# EAGLE design Input_v1_0 (EAGLE 9.6.2)
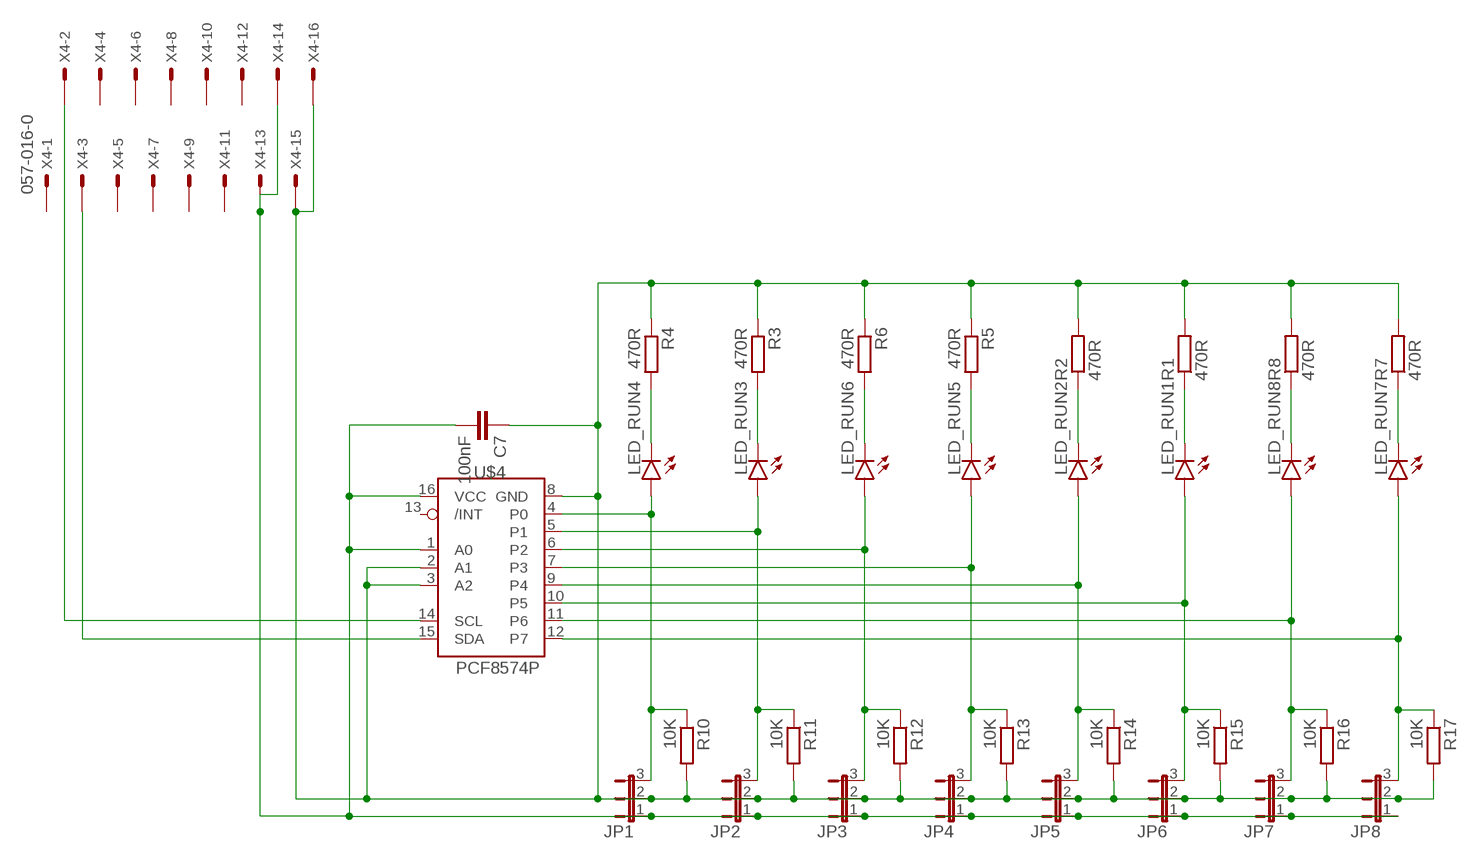
[diagram p0: schematic, sheet 1]

## Parts
C7  100nF  C-EU025-024X044  [C025-024X044]
JP1  JP2E  [JP2]
JP2  JP2E  [JP2]
JP3  JP2E  [JP2]
JP4  JP2E  [JP2]
JP5  JP2E  [JP2]
JP6  JP2E  [JP2]
JP7  JP2E  [JP2]
JP8  JP2E  [JP2]
LED_RUN1  LED3MM  [LED3MM]
LED_RUN2  LED3MM  [LED3MM]
LED_RUN3  LED3MM  [LED3MM]
LED_RUN4  LED3MM  [LED3MM]
LED_RUN5  LED3MM  [LED3MM]
LED_RUN6  LED3MM  [LED3MM]
LED_RUN7  LED3MM  [LED3MM]
LED_RUN8  LED3MM  [LED3MM]
R1  470R  R-EU_0309/10  [0309/10]
R2  470R  R-EU_0309/10  [0309/10]
R3  470R  R-EU_0309/10  [0309/10]
R4  470R  R-EU_0309/10  [0309/10]
R5  470R  R-EU_0309/10  [0309/10]
R6  470R  R-EU_0309/10  [0309/10]
R7  470R  R-EU_0309/10  [0309/10]
R8  470R  R-EU_0309/10  [0309/10]
R10  10K  R-EU_0309/10  [0309/10]
R11  10K  R-EU_0309/10  [0309/10]
R12  10K  R-EU_0309/10  [0309/10]
R13  10K  R-EU_0309/10  [0309/10]
R14  10K  R-EU_0309/10  [0309/10]
R15  10K  R-EU_0309/10  [0309/10]
R16  10K  R-EU_0309/10  [0309/10]
R17  10K  R-EU_0309/10  [0309/10]
U$4  PCF8574P  [DIL16]
X4  057-016-0  [057-016-0]

## Nets
GND1: C7.1 JP1.2 JP2.2 JP3.2 JP4.2 JP5.2 JP6.2 JP7.2 JP8.2 R1.2 R2.2 R3.1 R4.1 R5.1 R6.1 R7.2 R8.2 R10.2 R11.2 R12.2 R13.2 R14.2 R15.2 R16.2 R17.2 U$4.2(A1) U$4.3(A2) U$4.8(GND) X4.15 X4.16
N$1: LED_RUN7.K(C) R7.1
N$2: LED_RUN8.K(C) R8.1
N$3: LED_RUN1.K(C) R1.1
N$4: LED_RUN2.K(C) R2.1
N$5: LED_RUN5.K(C) R5.2
N$6: LED_RUN6.K(C) R6.2
N$7: LED_RUN3.K(C) R3.2
N$8: LED_RUN4.K(C) R4.2
N$9: U$4.15(SDA) X4.3
N$21: JP1.3 LED_RUN4.A R10.1 U$4.4(P0)
N$22: JP2.3 LED_RUN3.A R11.1 U$4.5(P1)
N$23: JP3.3 LED_RUN6.A R12.1 U$4.6(P2)
N$24: JP4.3 LED_RUN5.A R13.1 U$4.7(P3)
N$25: JP5.3 LED_RUN2.A R14.1 U$4.9(P4)
N$26: JP6.3 LED_RUN1.A R15.1 U$4.10(P5)
N$27: JP7.3 LED_RUN8.A R16.1 U$4.11(P6)
N$28: JP8.3 LED_RUN7.A R17.1 U$4.12(P7)
SCL: U$4.14(SCL) X4.2
VCC5.0: C7.2 JP1.1 JP2.1 JP3.1 JP4.1 JP5.1 JP6.1 JP7.1 JP8.1 U$4.1(A0) U$4.16(VCC) X4.13 X4.14
Unconnected: U$4.13(/INT) X4.1 X4.4 X4.5 X4.6 X4.7 X4.8 X4.9 X4.10 X4.11 X4.12

## Library data of the parts
C7 = resistor:C-EU: CAPACITOR, European symbol
JP1-JP8 = jumper:JP2E: JUMPER
LED_RUN1-LED_RUN8 = led:LED: LED OSRAM: - CHIPLED LG R971, LG N971, LY N971, LG Q971, LY Q971, LO R971, LY R971 LH N974, LH R974 LS Q976, LO Q976, LY Q976 LO Q996 - Hyper CHIPLED LW Q18S LB Q993, LB Q99A, LB R99A - SideLED LS A670, LO A670, LY A670, LG A670, LP A670 LB A673, LV A673, LT A673, LW A673 LH A674 LY A675 LS A676, LA A676, LO A676, LY A676, LW A676 LS A679, LY A679, LG A679 - Hyper Micro SIDELED® LS Y876, LA Y876, LO Y876, LY Y876 LT Y87S - SmartLED LW L88C, LW L88S LB L89C, LB L89S, LG L890 LS L89K, LO L89K, LY L89K LS L896, LA L896, LO L896, LY L896 - TOPLED LS T670, LO T670, LY T670, LG T670, LP T670 LSG T670, LSP T670, LSY T670, LOP T670, LYG T670 LG T671, LOG T671, LSG T671 LB T673, LV T673, LT T673, LW T673 LH T674 LS T676, LA T676, LO T676, LY T676, LB T676, LH T676, LSB T676, LW T676 LB T67C, LV T67C, LT T67C, LS T67K, LO T67K, LY T67K, LW E67C LS E67B, LA E67B, LO E67B, LY E67B, LB E67C, LV E67C, LT E67C LW T67C LS T679, LY T679, LG T679 LS T770, LO T770, LY T770, LG T770, LP T770 LB T773, LV T773, LT T773, LW T773 LH T774 LS E675, LA E675, LY E675, LS T675 LS T776, LA T776, LO T776, LY T776, LB T776 LHGB T686 LT T68C, LB T68C - Hyper Mini TOPLED® LB M676 - Mini TOPLED Santana® LG M470 LS M47K, LO M47K, LY M47K Source: http://www.osram.convergy.de LUXEON: - LUMILED® LXK2-PW12-R00, LXK2-PW12-S00, LXK2-PW14-U00, LXK2-PW14-V00 LXK2-PM12-R00, LXK2-PM12-S00, LXK2-PM14-U00 LXK2-PE12-Q00, LXK2-PE12-R00, LXK2-PE12-S00, LXK2-PE14-T00, LXK2-PE14-U00 LXK2-PB12-K00, LXK2-PB12-L00, LXK2-PB12-M00, LXK2-PB14-N00, LXK2-PB14-P00, LXK2-PB14-Q00 LXK2-PR12-L00, LXK2-PR12-M00, LXK2-PR14-Q00, LXK2-PR14-R00 LXK2-PD12-Q00, LXK2-PD12-R00, LXK2-PD12-S00 LXK2-PH12-R00, LXK2-PH12-S00 LXK2-PL12-P00, LXK2-PL12-Q00, LXK2-PL12-R00 Source: www.luxeon.com KINGBRIGHT: KA-3528ASYC Source: www.kingbright.com
R1-R8 R10-R17 = resistor:R-EU_: RESISTOR, European symbol
U$4 = i2c:PCF8574: Remote 8-Bit I/O Expander for I²C Bus
X4 = con-panduit:057-016-: CONNECTOR 10-pin series 057 contact pc board low profile headers; OC_FARNELL: unknown; OC_NEWARK: unknown

## Board
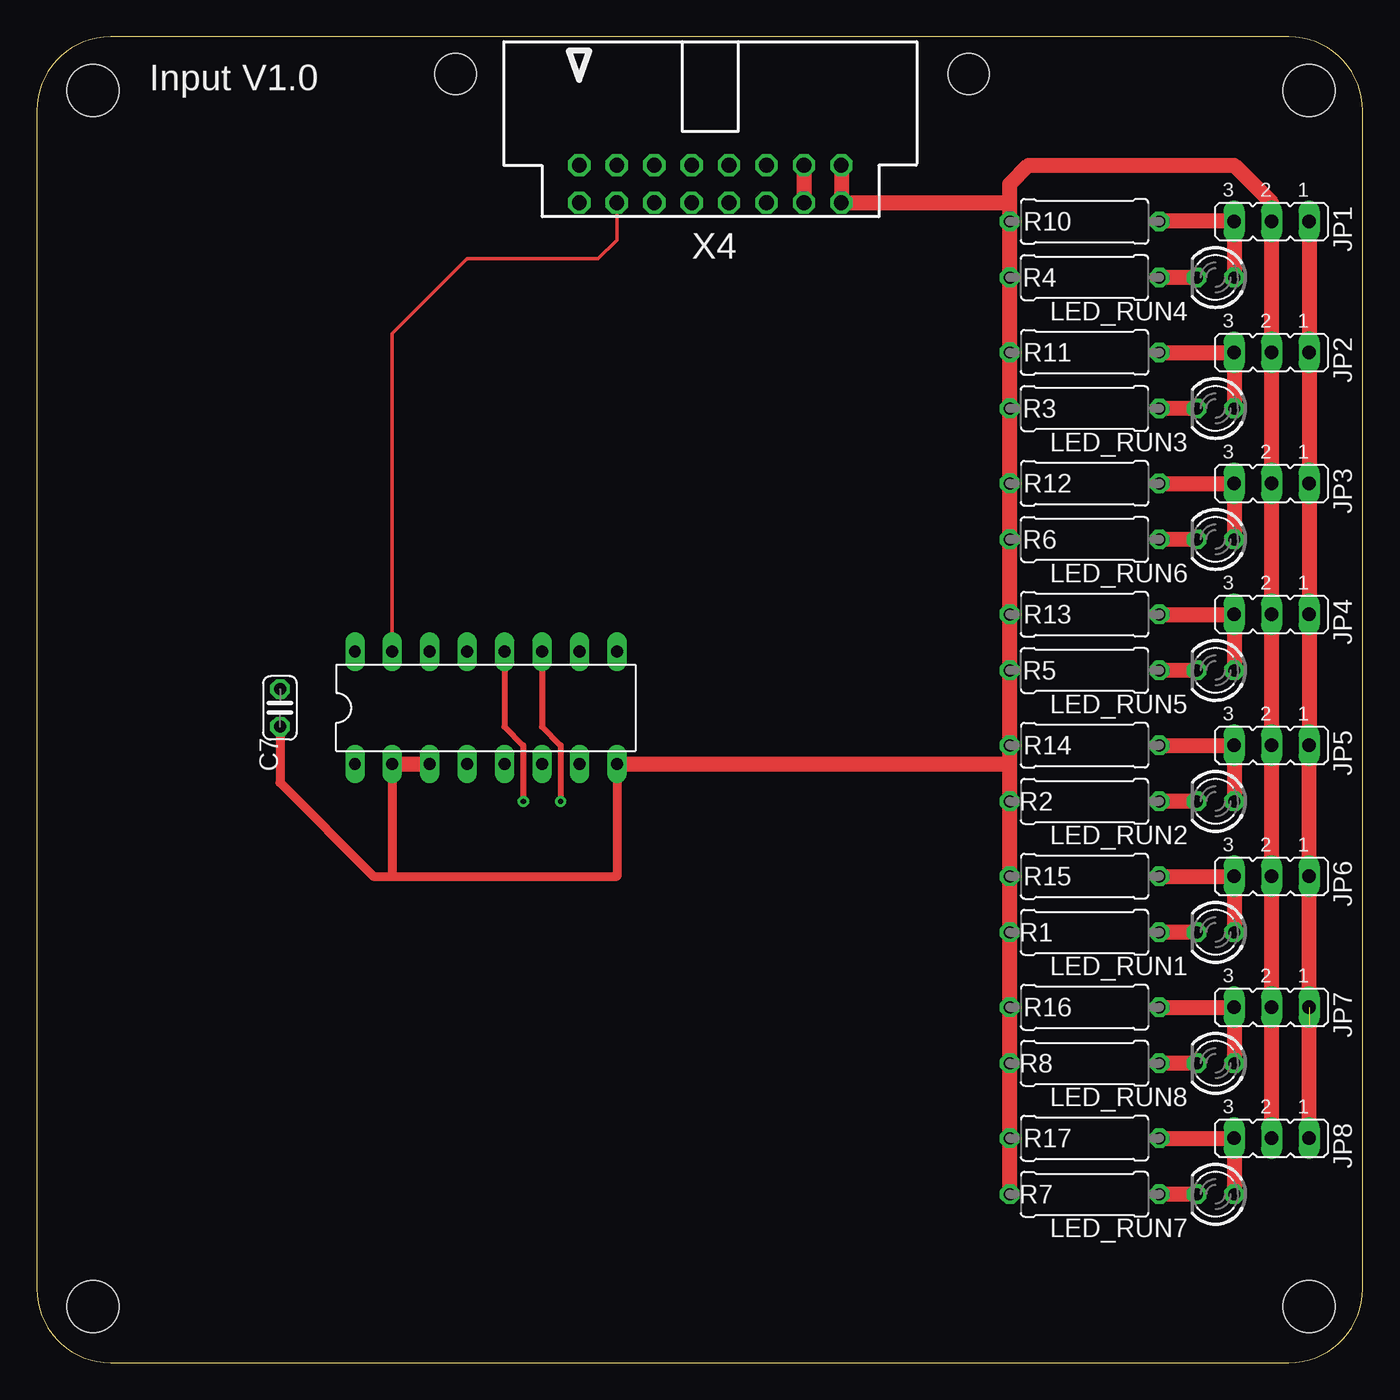
[diagram p1: board, top side]
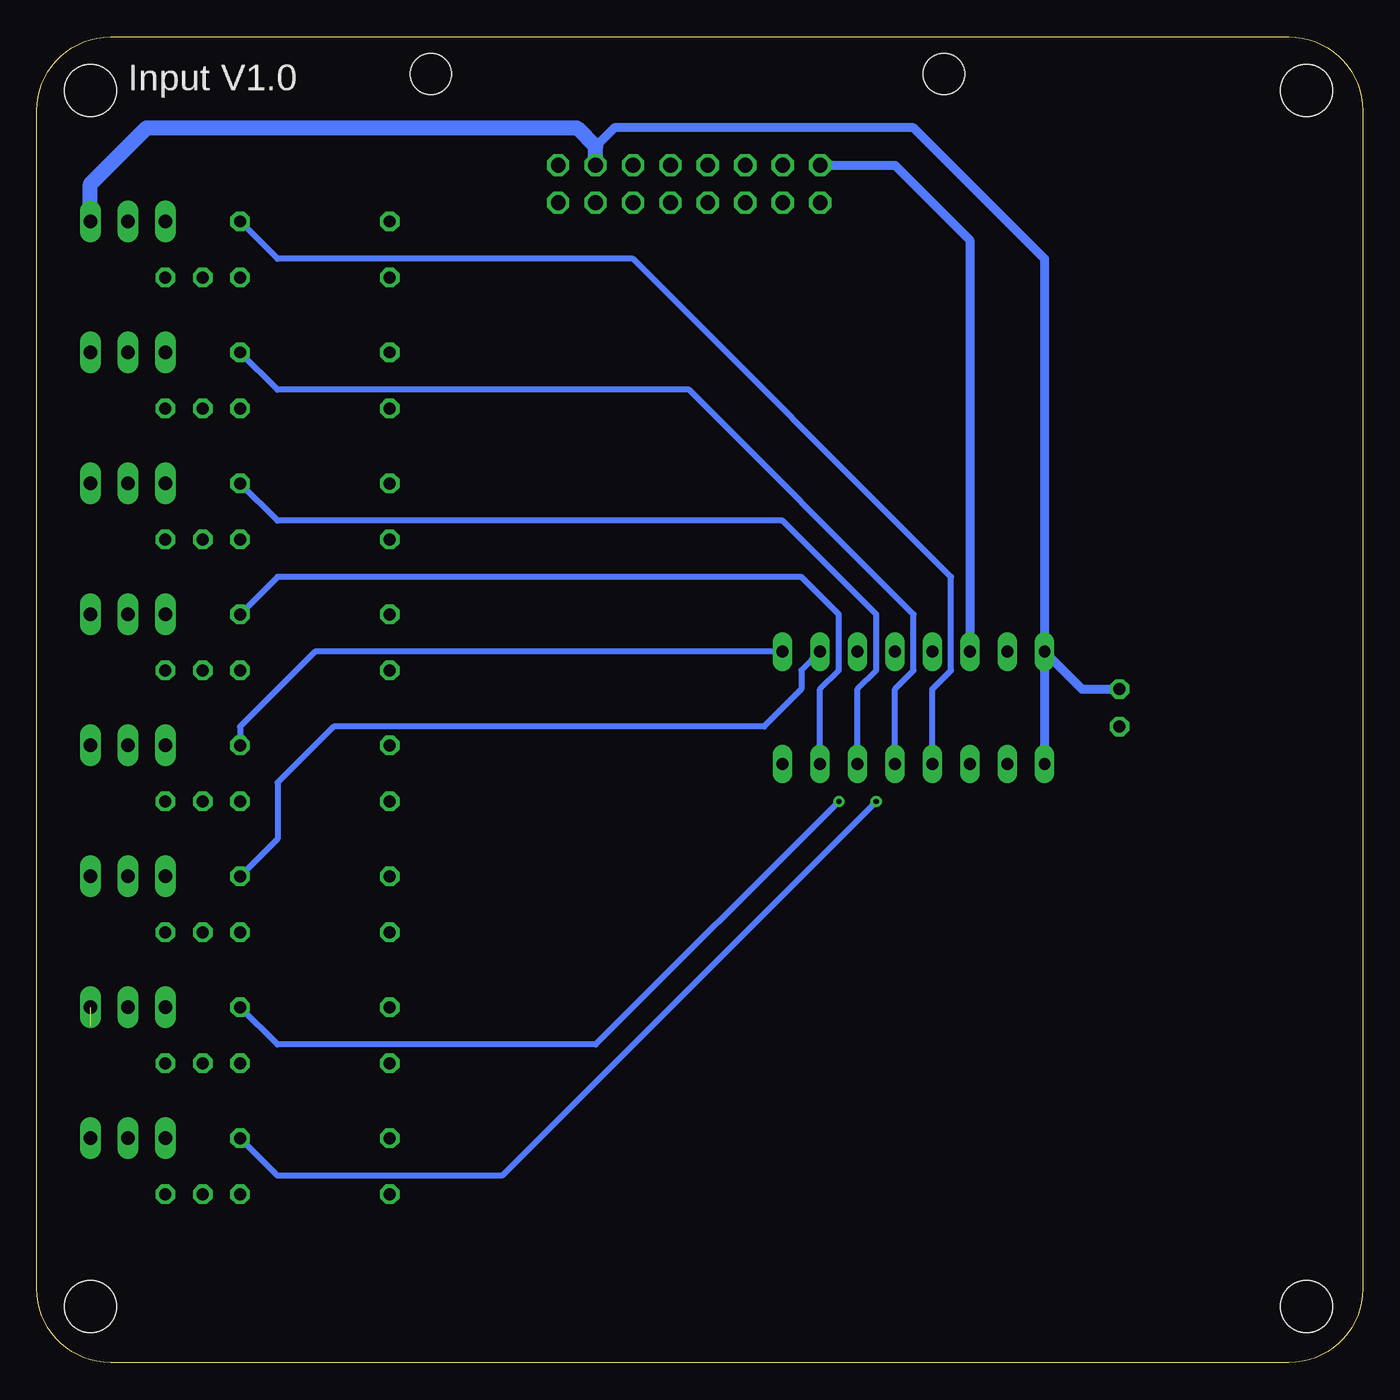
[diagram p2: board, bottom side, seen from below]

Size 90 x 90 mm. Coordinates in mm from the lower left corner, seen from the top.
Outline: 0,85 0,5 arc90 5,0 85,0 arc90 90,5 90,85 arc90 85,90 5,90 arc90 0,85
Copper layers (1*16): Top 0.035mm / dielectric 1.5mm / Bottom 0.035mm
Design rules "default": minimum track width 6mil, minimum drill 0.35mm, track to track 6mil, track to pad 6mil, pad to pad 6mil, via to via 6mil, smd to smd 6mil, copper to edge 40mil, drill to drill 6mil, minimum pad ring 10mil, minimum via ring 8mil, stop-mask expansion 4mil, vias tented up to drill 0mil, thermal gap 10mil
Holes 3.5 mm at 86.36,86.36 3.81,86.36 3.81,3.81 86.36,3.81

### Footprints (pad centres in the part's own frame; a part is rotated, then mirrored left to right if it is on the bottom)
C025-024X044 = drill 0.813 octagon: 1 -1.27,0; 2 1.27,0
JP2 = drill 0.914 long: 1 -2.54,0; 2 0,0; 3 2.54,0
LED3MM = drill 0.813 octagon: A -1.27,0; K 1.27,0
0309/10 = drill 0.813 octagon: 1 -5.08,0; 2 5.08,0
DIL16 = drill 0.813 long: 1 -8.89,-3.81; 2 -6.35,-3.81; 3 -3.81,-3.81; 4 -1.27,-3.81; 5 1.27,-3.81; 6 3.81,-3.81; 7 6.35,-3.81; 8 8.89,-3.81; 9 8.89,3.81; 10 6.35,3.81; 11 3.81,3.81; 12 1.27,3.81; 13 -1.27,3.81; 14 -3.81,3.81; 15 -6.35,3.81; 16 -8.89,3.81
057-016-0 = drill 1 octagon: 1 -8.89,-5.08; 2 -8.89,-2.54; 3 -6.35,-5.08; 4 -6.35,-2.54; 5 -3.81,-5.08; 6 -3.81,-2.54; 7 -1.27,-5.08; 8 -1.27,-2.54; 9 1.27,-5.08; 10 1.27,-2.54; 11 3.81,-5.08; 12 3.81,-2.54; 13 6.35,-5.08; 14 6.35,-2.54; 15 8.89,-5.08; 16 8.89,-2.54 | hole 2.8: -17.29,3.66; 17.54,3.66

### Placement (x,y rotation side)
C7  16.51,44.45 90 top
JP1  83.82,77.47 180 top
JP2  83.82,68.58 180 top
JP3  83.82,59.69 180 top
JP4  83.82,50.8 180 top
JP5  83.82,41.91 180 top
JP6  83.82,33.02 180 top
JP7  83.82,24.13 180 top
JP8  83.82,15.24 180 top
LED_RUN1  80.01,29.21 180 top
LED_RUN2  80.01,38.1 180 top
LED_RUN3  80.01,64.77 180 top
LED_RUN4  80.01,73.66 180 top
LED_RUN5  80.01,46.99 180 top
LED_RUN6  80.01,55.88 180 top
LED_RUN7  80.01,11.43 180 top
LED_RUN8  80.01,20.32 180 top
R1  71.12,29.21 180 top
R2  71.12,38.1 180 top
R3  71.12,64.77 0 top
R4  71.12,73.66 0 top
R5  71.12,46.99 0 top
R6  71.12,55.88 0 top
R7  71.12,11.43 180 top
R8  71.12,20.32 180 top
R10  71.12,77.47 180 top
R11  71.12,68.58 180 top
R12  71.12,59.69 180 top
R13  71.12,50.8 180 top
R14  71.12,41.91 180 top
R15  71.12,33.02 180 top
R16  71.12,24.13 180 top
R17  71.12,15.24 180 top
U$4  30.48,44.45 0 top
X4  45.72,83.82 0 top

### Tracks (layer width: path | path; a pad name or v marks a point on that pad's centre or on a via)
GND1
  Top 0.61: C7.1 16.51,39.37 22.86,33.02 24.13,33.02 | 24.13,33.02 39.37,33.02 U$4.8 | U$4.2 24.13,33.02
  Top 1.016: X4.16 X4.15 66.04,78.74 | JP8.2 JP7.2 JP6.2 JP5.2 JP4.2 JP3.2 JP2.2 JP1.2 83.82,78.74 81.28,81.28 67.31,81.28 66.04,80.01 66.04,78.74 | R7.2 R17.2 R8.2 R16.2 R1.2 R15.2 R2.2 66.04,40.64 | 66.04,40.64 R14.2 R5.1 R13.2 R6.1 R12.2 R3.1 R11.2 R4.1 R10.2 66.04,78.74 | U$4.8 66.04,40.64 | U$4.2 U$4.3
N$1
  Top 1.016: LED_RUN7.K R7.1
N$2
  Top 1.016: LED_RUN8.K R8.1
N$3
  Top 1.016: LED_RUN1.K R1.1
N$4
  Top 1.016: LED_RUN2.K R2.1
N$5
  Top 1.016: LED_RUN5.K R5.2
N$6
  Top 1.016: LED_RUN6.K R6.2
N$7
  Top 1.016: LED_RUN3.K R3.2
N$8
  Top 1.016: LED_RUN4.K R4.2
N$9
  Top 0.254: U$4.15 24.13,69.85 29.21,74.93 38.1,74.93 39.37,76.2 X4.3
N$21
  Top 1.016: LED_RUN4.A JP1.3 R10.1
  Bottom 0.406: U$4.4 29.21,45.72 27.94,46.99 27.94,53.34 49.53,74.93 73.66,74.93 R10.1
N$22
  Top 1.016: R11.1 JP2.3 LED_RUN3.A
  Bottom 0.406: U$4.5 31.75,45.72 30.48,46.99 30.48,50.8 45.72,66.04 73.66,66.04 R11.1
N$23
  Top 1.016: R12.1 JP3.3 LED_RUN6.A
  Bottom 0.406: U$4.6 34.29,45.72 33.02,46.99 33.02,50.8 39.37,57.15 73.66,57.15 R12.1
N$24
  Top 1.016: R13.1 JP4.3 LED_RUN5.A
  Bottom 0.406: U$4.7 36.83,45.72 35.56,46.99 35.56,50.8 38.1,53.34 73.66,53.34 R13.1
N$25
  Top 1.016: R14.1 JP5.3 LED_RUN2.A
  Bottom 0.406: U$4.9 71.12,48.26 76.2,43.18 R14.1
N$26
  Top 1.016: R15.1 JP6.3 LED_RUN1.A
  Bottom 0.406: U$4.10 38.1,46.99 38.1,45.72 40.64,43.18 69.85,43.18 73.66,39.37 73.66,35.56 R15.1
N$27  (via drill 0.35)
  Top 0.406: U$4.11 34.29,43.18 35.56,41.91 v35.56,38.1
  Top 1.016: R16.1 JP7.3 LED_RUN8.A
  Bottom 0.406: v35.56,38.1 52.07,21.59 73.66,21.59 R16.1
N$28  (via drill 0.35)
  Top 0.406: v33.02,38.1 33.02,41.91 31.75,43.18 U$4.12
  Top 1.016: R17.1 JP8.3 LED_RUN7.A
  Bottom 0.406: v33.02,38.1 58.42,12.7 73.66,12.7 R17.1
SCL
  Bottom 0.61: X4.2 31.75,81.28 26.67,76.2 U$4.14
VCC5.0  (1 unrouted)
  Top 1.016: X4.14 X4.13 | JP1.1 JP2.1 JP3.1 JP4.1 JP5.1 JP6.1 JP7.1 | JP8.1 86.36,22.86
  Bottom 0.61: 52.07,82.55 50.8,83.82 30.48,83.82 21.59,74.93 U$4.16 | U$4.16 19.05,45.72 C7.2 | U$4.16 U$4.1
  Bottom 1.016: JP1.1 86.36,80.01 82.55,83.82 53.34,83.82 52.07,82.55 X4.14

### Text on the board
tNames: Input V1.0
bNames: Input V1.0